# EAGLE design umodular_brain8_arduino_mega_rev01 (EAGLE 7.2.0)
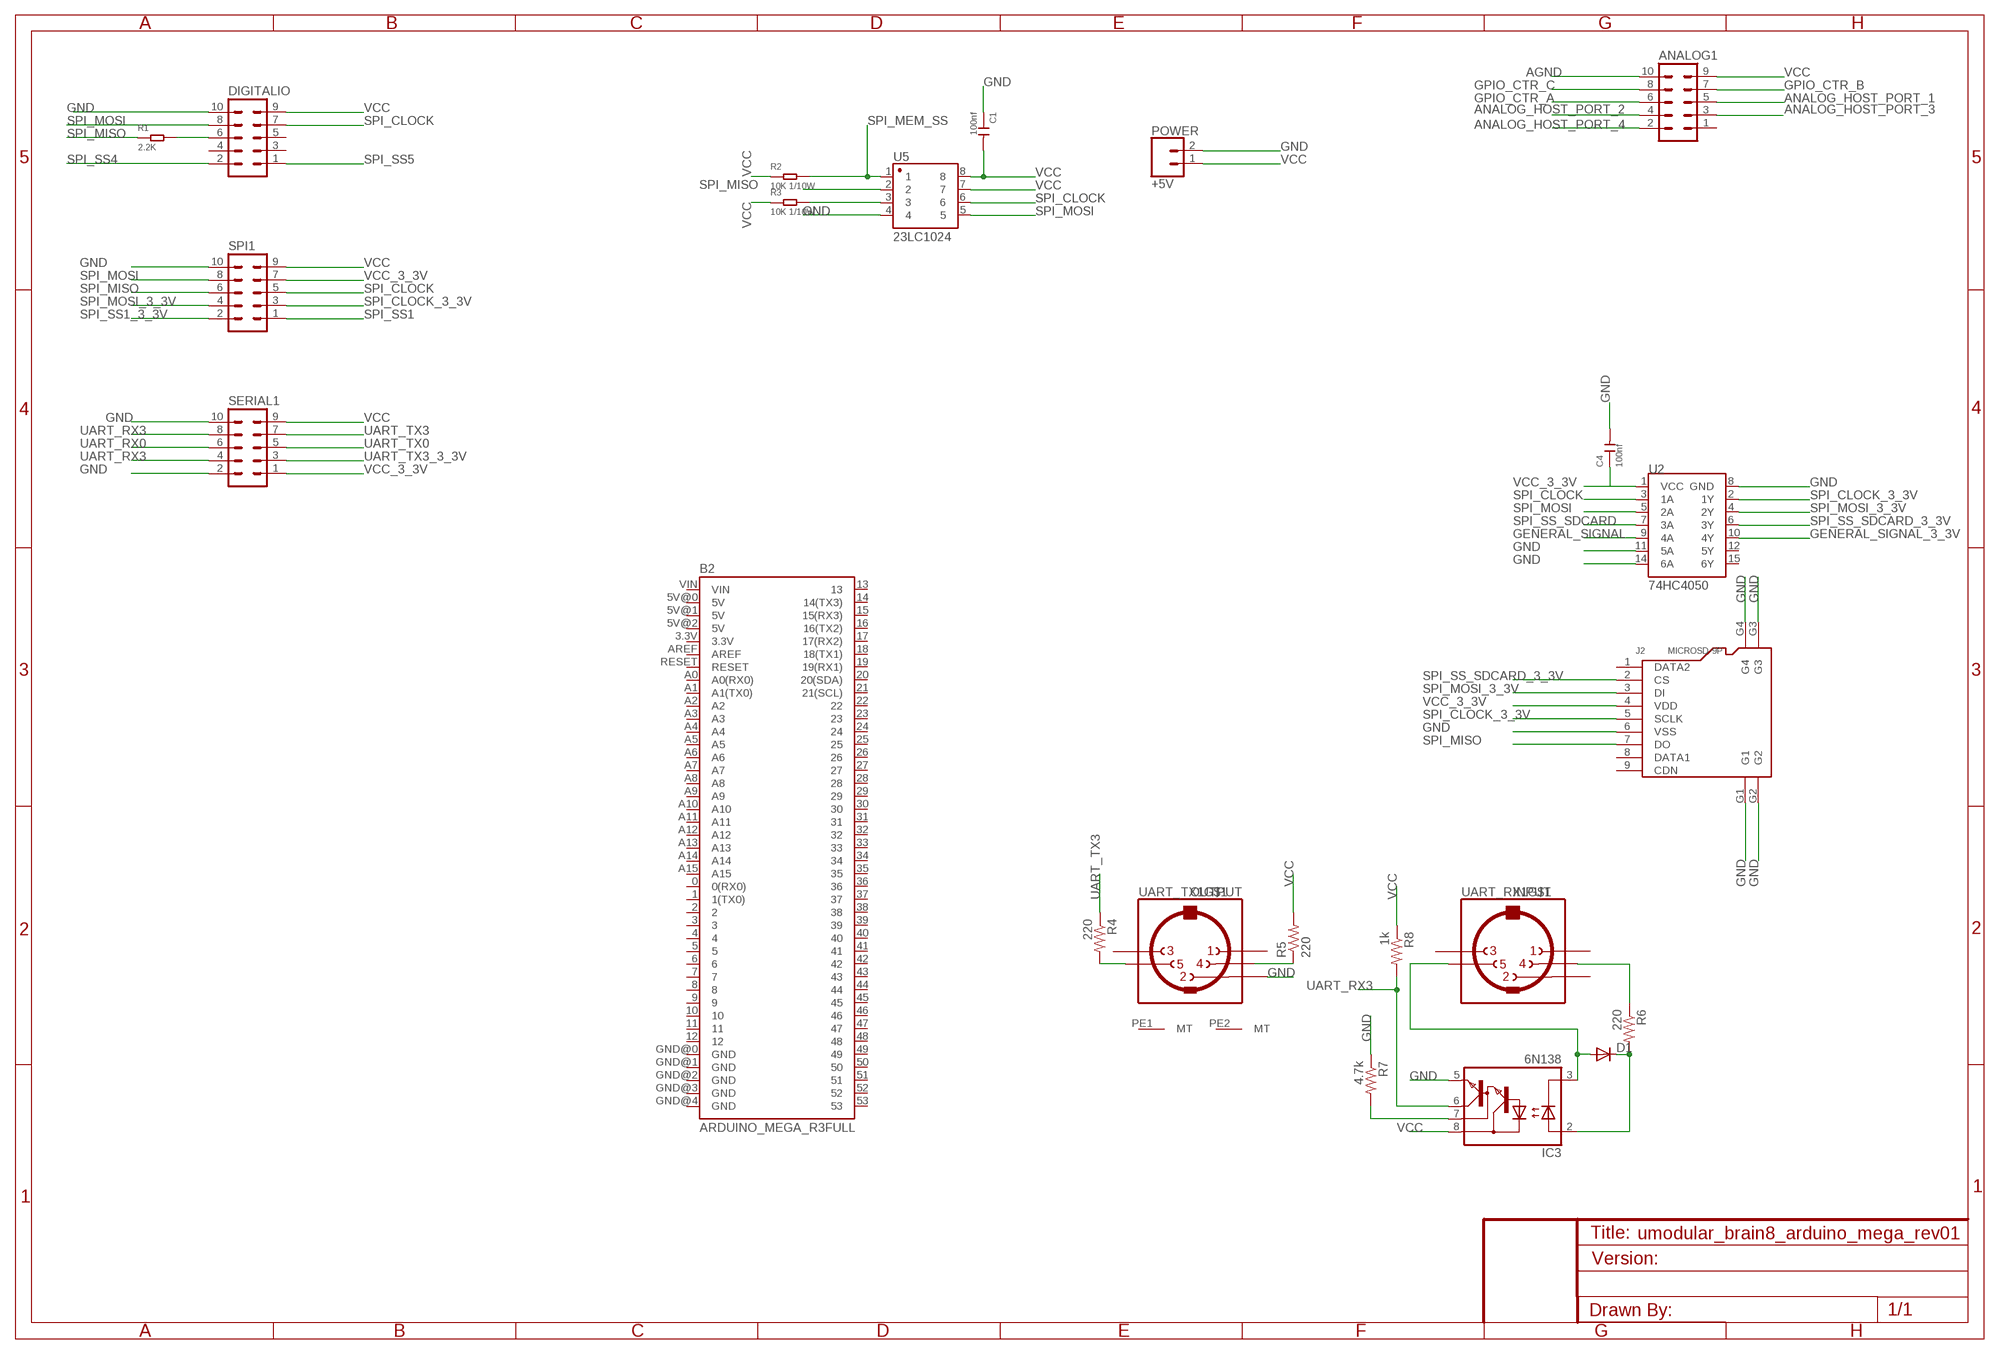
[diagram p0: schematic, sheet 1]

## Parts
ANALOG1  MA05-2  [MA05-2]
B2  ARDUINO_MEGA_R3FULL  [ARDUINO_MEGA]
C1  100nf  CERAMIC-100NF-50V-10%-X7R(0805)  [C0805]
C4  100nf  CERAMIC-100NF-50V-10%-X7R(0805)  [C0805]
D1  1N4148DO35-7  [DO35-7]
DIGITALIO  MA05-2  [MA05-2]
IC3  6N138  [DIL08]
J2  MICROSD-9P  MICRO-SD-CARD-HOLDER-9P  [MICRO-SD9+4P-SMD-16.1X14.5X1.85MM]
POWER  +5V  CONN_02LOCK_LONGPADS  [1X02_LOCK_LONGPADS]
R1  2.2K  SMD-RES-2.2K-5%-1/10W(0603)  [R0603]
R2  10K 1/10W  SMD-RES-10K-5%-1/10W(0603)  [R0603]
R3  10K 1/10W  SMD-RES-10K-5%-1/10W(0603)  [R0603]
R4  220  R-US_0204/7  [0204/7@1]
R5  220  R-US_0204/7  [0204/7@1]
R6  220  R-US_0204/7  [0204/7@1]
R7  4.7k  R-US_0204/7  [0204/7@1]
R8  1k  R-US_0204/7  [0204/7@1]
SERIAL1  MA05-2  [MA05-2]
SPI1  MA05-2  [MA05-2]
U2  74HC4050  HEX_CONVERTER  [SO16]
U5  23LC1024  GENERIC-SOIC8MSGEQ7N-FILTER  [SO08]
UART_RX1  INPUT  MIDIJACK  [CP-2350]
UART_TX1  OUTPUT  MIDIJACK  [CP-2350]

## Nets
AGND: ANALOG1.10
ANALOG_HOST_PORT_1: ANALOG1.5
ANALOG_HOST_PORT_2: ANALOG1.4
ANALOG_HOST_PORT_3: ANALOG1.3
ANALOG_HOST_PORT_4: ANALOG1.2
GENERAL_SIGNAL: U2.9(4A)
GENERAL_SIGNAL_3_3V: U2.10(4Y)
GND: C1.1 C4.2 DIGITALIO.10 IC3.5(GND) J2.6(VSS) J2.G1 J2.G2 J2.G3 J2.G4 POWER.2 R7.1 SERIAL1.2 SERIAL1.10 SPI1.10 U2.8(GND) U2.11(5A) U2.14(6A) U5.4 UART_TX1.2
GPIO_CTR_A: ANALOG1.6
GPIO_CTR_B: ANALOG1.7
GPIO_CTR_C: ANALOG1.8
N$2: R5.1 UART_TX1.4
N$3: R4.2 UART_TX1.5
N$4: R3.2 U5.3
N$5: R6.1 UART_RX1.4
N$6: D1.C IC3.2(A) R6.2
N$7: D1.A IC3.3(C) UART_RX1.5
N$8: IC3.7(VB) R7.2
N$9: DIGITALIO.6 R1.2
SPI_CLOCK: DIGITALIO.7 SPI1.5 U2.3(1A) U5.6
SPI_CLOCK_3_3V: J2.5(SCLK) SPI1.3 U2.2(1Y)
SPI_MEM_SS: R2.2 U5.1
SPI_MISO: J2.7(DO) R1.1 SPI1.6 U5.2
SPI_MOSI: DIGITALIO.8 SPI1.8 U2.5(2A) U5.5
SPI_MOSI_3_3V: J2.3(DI) SPI1.4 U2.4(2Y)
SPI_SS1: SPI1.1
SPI_SS1_3_3V: SPI1.2
SPI_SS4: DIGITALIO.2
SPI_SS5: DIGITALIO.1
SPI_SS_SDCARD: U2.7(3A)
SPI_SS_SDCARD_3_3V: J2.2(CS) U2.6(3Y)
UART_RX0: SERIAL1.6
UART_RX3: IC3.6(VO) R8.2 SERIAL1.4 SERIAL1.8
UART_TX0: SERIAL1.5
UART_TX3: R4.1 SERIAL1.7
UART_TX3_3_3V: SERIAL1.3
VCC: ANALOG1.9 C1.2 DIGITALIO.9 IC3.8(VCC) POWER.1 R2.1 R3.1 R5.2 R8.1 SERIAL1.9 SPI1.9 U5.7 U5.8
VCC_3_3V: C4.1 J2.4(VDD) SERIAL1.1 SPI1.7 U2.1(VCC)
Unconnected: ANALOG1.1 B2.0(0(RX0)) B2.1(1(TX0)) B2.2 B2.3 B2.3.3V B2.4 B2.5 B2.5V@0(5V) B2.5V@1(5V) B2.5V@2(5V) B2.6 B2.7 B2.8 B2.9 B2.10 B2.11 B2.12 B2.13 B2.14(14(TX3)) B2.15(15(RX3)) B2.16(16(TX2)) B2.17(17(RX2)) B2.18(18(TX1)) B2.19(19(RX1)) B2.20(20(SDA)) B2.21(21(SCL)) B2.22 B2.23 B2.24 B2.25 B2.26 B2.27 B2.28 B2.29 B2.30 B2.31 B2.32 B2.33 B2.34 B2.35 B2.36 B2.37 B2.38 B2.39 B2.40 B2.41 B2.42 B2.43 B2.44 B2.45 B2.46 B2.47 B2.48 B2.49 B2.50 B2.51 B2.52 B2.53 B2.A0(A0(RX0)) B2.A1(A1(TX0)) B2.A2 B2.A3 B2.A4 B2.A5 B2.A6 B2.A7 B2.A8 B2.A9 B2.A10 B2.A11 B2.A12 B2.A13 B2.A14 B2.A15 B2.AREF B2.GND@0(GND) B2.GND@1(GND) B2.GND@2(GND) B2.GND@3(GND) B2.GND@4(GND) B2.RESET B2.VIN DIGITALIO.3 DIGITALIO.4 DIGITALIO.5 J2.1(DATA2) J2.8(DATA1) J2.9(CDN) U2.12(5Y) U2.15(6Y) UART_RX1.1 UART_RX1.2 UART_RX1.3 UART_RX1.PE1(MT) UART_RX1.PE2(MT) UART_RX1.PE(MT) UART_RX1.PE@(MT) UART_TX1.1 UART_TX1.3 UART_TX1.PE1(MT) UART_TX1.PE2(MT) UART_TX1.PE(MT) UART_TX1.PE@(MT)

## Library data of the parts
ANALOG1 DIGITALIO SERIAL1 SPI1 = con-lstb:MA05-2: PIN HEADER; OC_FARNELL: unknown; OC_NEWARK: unknown
B2 = SparkFun-Boards-mod:ARDUINO_MEGA_R3: Arduino Mega R3 ATmega2560 R3 compatible footprint. SparkFun Products: Arduino Mega 2560 R3 <https://www.sparkfun.com/products/11061>
C1 C4 = Seeed-Capacitor-2016:CERAMIC-100NF-50V-10%-X7R(0805): 302010165; MPN: CC0805KRX7R9BB104
D1 = diode:1N4148: DIODE high speed (Philips)
IC3 = optocoupler:6N138: MOTOROLA OPTO COUPLER; MF: VISHAY/TELEFUNKEN; MPN: 6N138; OC_FARNELL: 9860150; OC_NEWARK: 35K5294
J2 = Seeed-Connector -2016:MICRO-SD-CARD-HOLDER-9P: 320090008
POWER = SparkFun-Connectors:CONN_02: Multi connection point. Often used as Generic Header-pin footprint for 0.1 inch spaced/style header connections On any of the 0.1 inch spaced packages, you can populate with these: Break Away Headers - Straight <https://www.sparkfun.com/products/116> (PRT-00116) Break Away Male Headers - Right Angle <https://www.sparkfun.com/products/553> (PRT-00553) Female Headers <https://www.sparkfun.com/products/115> (PRT-00115) Break Away Headers - Machine Pin <https://www.sparkfun.com/products/117> (PRT-00117) Break Away Female Headers - Swiss Machine Pin <https://www.sparkfun.com/products/743> (PRT-00743) For SCREWTERMINALS and SPRING TERMINALS visit here: Screw Terimnals on SparkFun.com <https://www.sparkfun.com/search/results?term=Screw+Terminals> (5mm/3.5mm/2.54mm spacing) This device is also useful as a general connection point to wire up your design to another part of your project. Our various solder wires solder well into these plated through hole pads. Hook-Up Wire - Assortment (Stranded, 22 AWG) <https://www.sparkfun.com/products/11375> (PRT-11375) Hook-Up Wire - Assortment (Solid Core, 22 AWG) <https://www.sparkfun.com/products/11367> (PRT-11367) View the entire wire category on our website here <https://www.sparkfun.com/categories/141> Special notes: Molex polarized connector foot print use with: PRT-08233 with associated crimp pins and housings. 2.54_SCREWTERM for use with PRT-10571. 3.5mm Screw Terminal footprints for PRT-08084 5mm Screw Terminal footprints for use with PRT-08432
R1 = Seeed-Resistor-2016:SMD-RES-2.2K-5%-1/10W(0603): 301010124; MPN: RC0603JR-072K2L
R2 R3 = Seeed-Resistor-2016:SMD-RES-10K-5%-1/10W(0603): 301010293; MPN: RC0603JR-0710KL
R4-R8 = rcl:R-US_: RESISTOR, American symbol
U2 = SparkFun-IC-Comms:HEX_CONVERTER: 74HC4050 Hex Buffer 74HC4050 Hex Buffer Level Shifter SMD SO016 SparkFun Products CAN-BUS Shield <https://www.sparkfun.com/products/13262> (DEV-13262) SparkFun MP3 Player Shield <https://www.sparkfun.com/products/12660> (DEV-12660) SparkFun microSD Shield <https://www.sparkfun.com/products/12761> (DEV-12761) SparkFun USB Host Shield <https://www.sparkfun.com/products/9947> (DEV-09947); PROD_ID: IC-09604
U5 = SparkFun-Retired:GENERIC-SOIC8: A placeholder for generic narrow & wide SOIC8 foorptints - used on the DIP adapter board. Has strange reference to IC-10141, a Seven Band Graphic Equalizer Display Filter SOIC-8 VFP: IC-10141; PROD_ID: IC-10141
UART_RX1 UART_TX1 = adafruit:MIDIJACK: DIN 5 jack also known as MIDI jack A modification of conn-hirshman:MAB5SH with two options for the grounding 'teeth'

## Net classes
0 default: width 0.305 mm

## Board
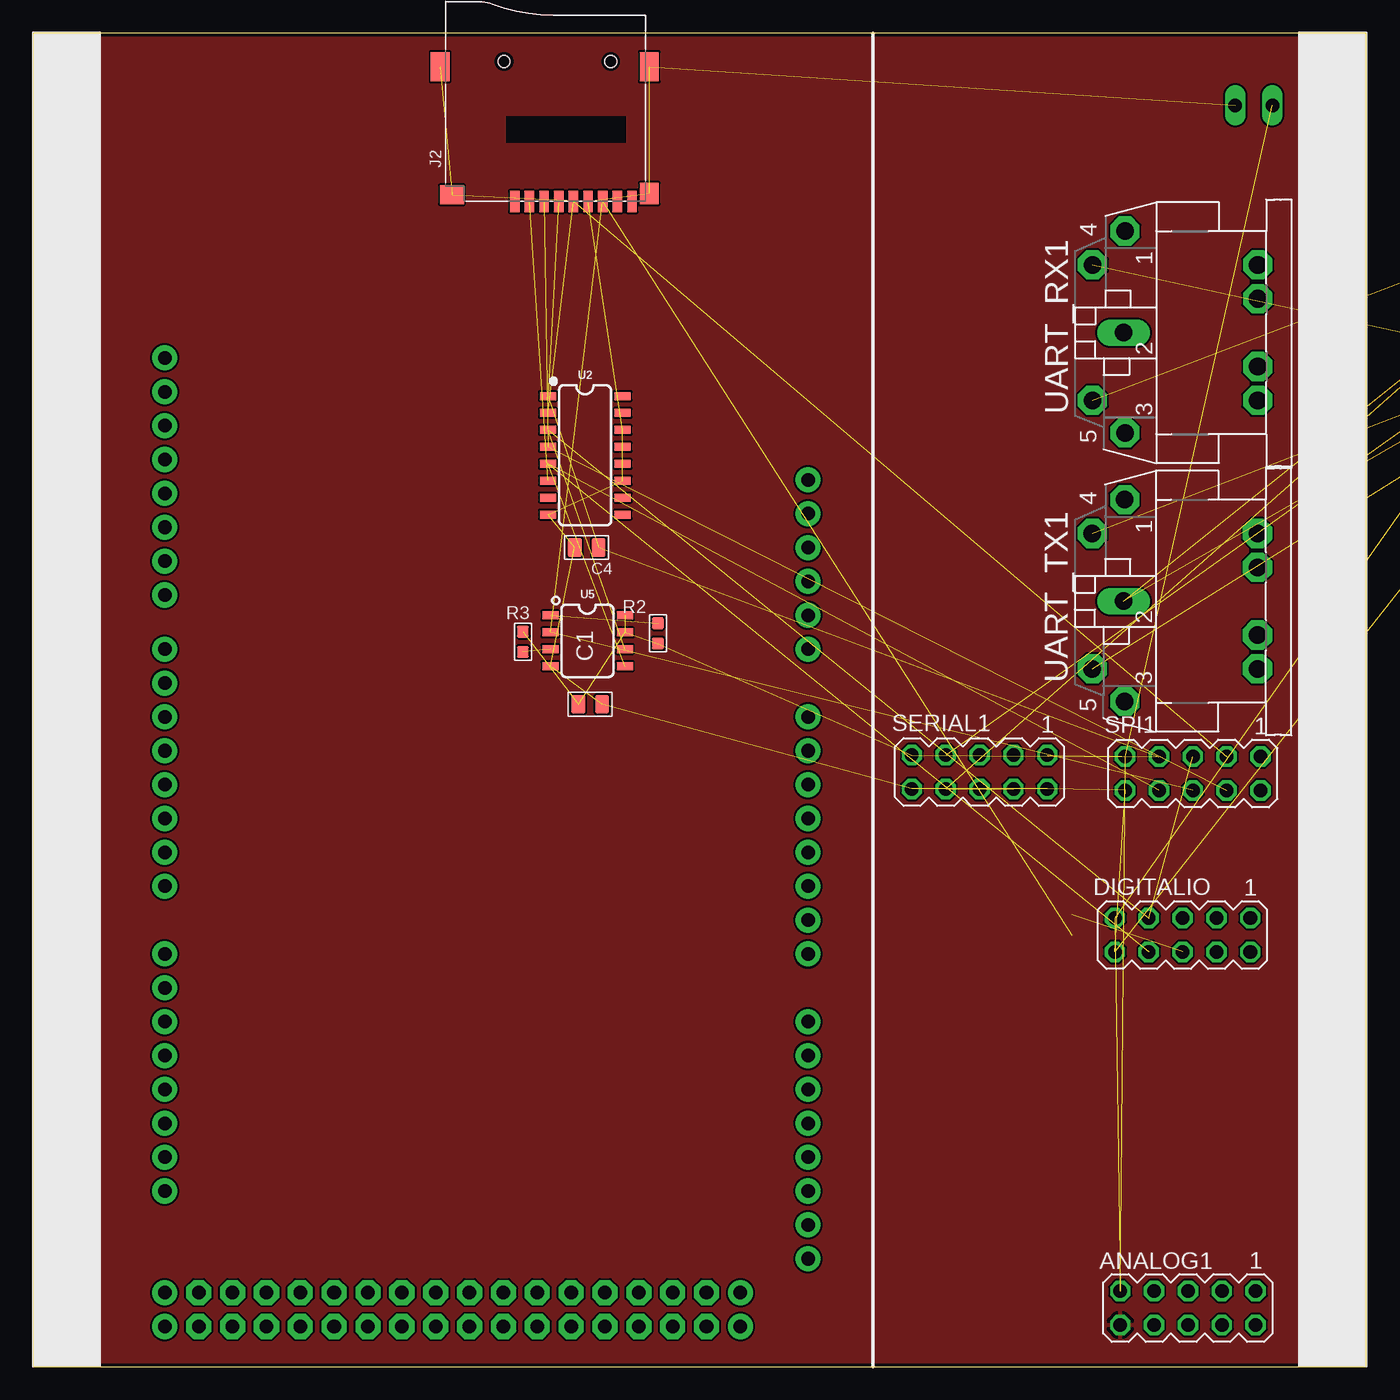
[diagram p1: board, top side]
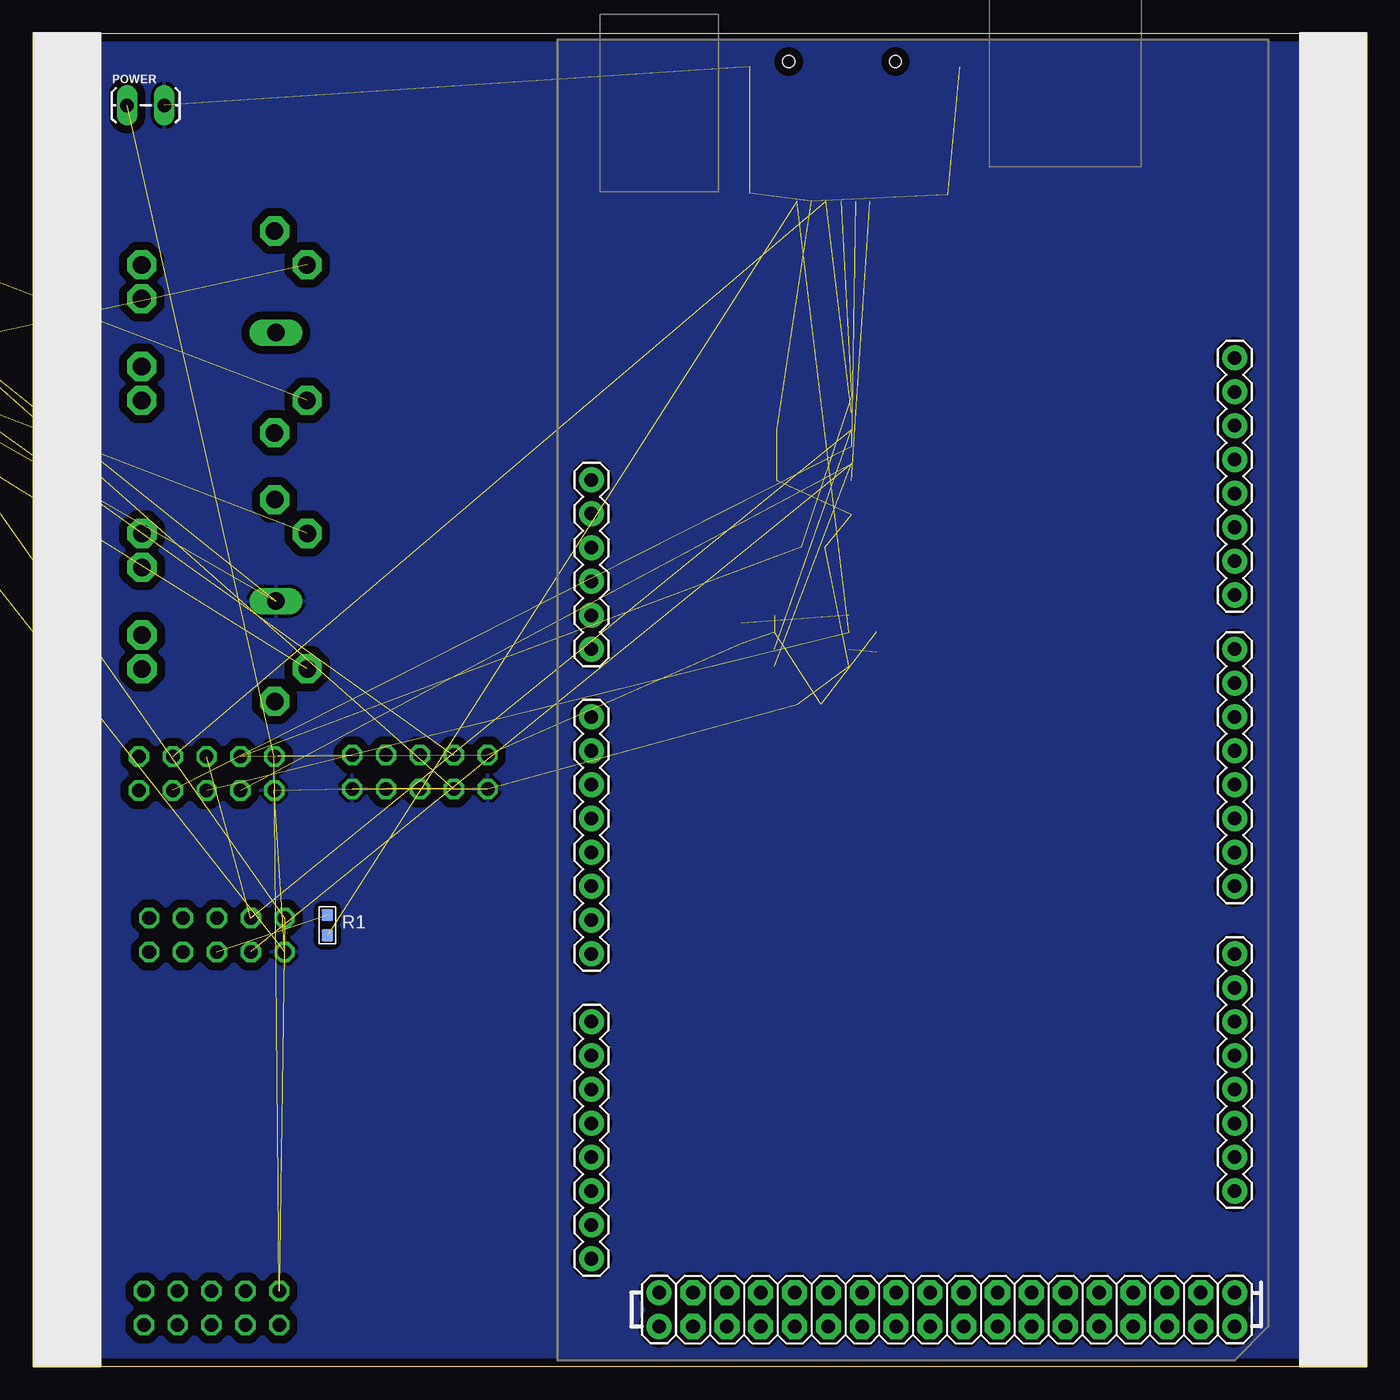
[diagram p2: board, bottom side, seen from below]

Size 100 x 100 mm. Coordinates in mm from the lower left corner, seen from the top.
Outline: 0,0 100,0 100,100 0,100 0,0
Copper layers (1*16): Top 0.035mm / dielectric 1.5mm / Bottom 0.035mm
Design rules "SeeedStudio_2layer_DRU_no_angle_20140221": minimum track width 6mil, minimum drill 12mil, track to track 6mil, track to pad 6mil, pad to pad 6mil, via to via 6mil, smd to smd 0mil, copper to edge 10mil, drill to drill 10mil, minimum pad ring 10mil, minimum via ring 6mil, stop-mask expansion 2mil, vias tented up to drill 100mil, thermal gap 10mil

### Footprints (pad centres in the part's own frame; a part is rotated, then mirrored left to right if it is on the bottom)
MA05-2 = drill 1.016 octagon: 1 -5.08,-1.27; 2 -5.08,1.27; 3 -2.54,-1.27; 4 -2.54,1.27; 5 0,-1.27; 6 0,1.27; 7 2.54,-1.27; 8 2.54,1.27; 9 5.08,-1.27; 10 5.08,1.27
ARDUINO_MEGA = drill 1.016 pad 1.88: 0 13.97,24.13; 1 11.43,24.13; 2 8.89,24.13; 3 6.35,24.13; 3.3V -13.97,-24.13; 4 3.81,24.13; 5 1.27,24.13; 5V@0 -11.43,-24.13; 5V@1 44.45,24.13; 5V@2 46.99,24.13; 6 -1.27,24.13; 7 -3.81,24.13; 8 -7.874,24.13; 9 -10.414,24.13; 10 -12.954,24.13; 11 -15.494,24.13; 12 -18.034,24.13; 13 -20.574,24.13; 14 19.05,24.13; 15 21.59,24.13; 16 24.13,24.13; 17 26.67,24.13; 18 29.21,24.13; 19 31.75,24.13; 20 34.29,24.13; 21 36.83,24.13; A0 1.27,-24.13; A1 3.81,-24.13; A2 6.35,-24.13; A3 8.89,-24.13; A4 11.43,-24.13; A5 13.97,-24.13; A6 16.51,-24.13; A7 19.05,-24.13; A8 24.13,-24.13; A9 26.67,-24.13; A10 29.21,-24.13; A11 31.75,-24.13; A12 34.29,-24.13; A13 36.83,-24.13; A14 39.37,-24.13; A15 41.91,-24.13; AREF -25.654,24.13; GND@0 -8.89,-24.13; GND@1 -6.35,-24.13; GND@2 44.45,-19.05; GND@3 46.99,-19.05; GND@4 -23.114,24.13; RESET -16.51,-24.13; VIN -3.81,-24.13 | drill 1.016 pad 1.88 octagon: 22 44.45,21.59; 23 46.99,21.59; 24 44.45,19.05; 25 46.99,19.05; 26 44.45,16.51; 27 46.99,16.51; 28 44.45,13.97; 29 46.99,13.97; 30 44.45,11.43; 31 46.99,11.43; 32 44.45,8.89; 33 46.99,8.89; 34 44.45,6.35; 35 46.99,6.35; 36 44.45,3.81; 37 46.99,3.81; 38 44.45,1.27; 39 46.99,1.27; 40 44.45,-1.27; 41 46.99,-1.27; 42 44.45,-3.81; 43 46.99,-3.81; 44 44.45,-6.35; 45 46.99,-6.35; 46 44.45,-8.89; 47 46.99,-8.89; 48 44.45,-11.43; 49 46.99,-11.43; 50 44.45,-13.97; 51 46.99,-13.97; 52 44.45,-16.51; 53 46.99,-16.51
C0805 = smd 1.397 x 1.016: 1 0,0.889; 2 0,-0.889
DO35-7 = drill 0.813 long: A 3.81,0; C -3.81,0
DIL08 = drill 0.813 offset: 1 -3.81,-3.81; 2 -1.27,-3.81; 3 1.27,-3.81; 4 3.81,-3.81; 5 3.81,3.81; 6 1.27,3.81; 7 -1.27,3.81; 8 -3.81,3.81
MICRO-SD9+4P-SMD-16.1X14.5X1.85MM = smd 1.6 x 0.7: 1 0,2.25; 2 0,1.15; 3 0,0.05; 4 0,-1.05; 5 0,-2.15; 6 0,-3.25; 7 0,-4.35; 8 0,-5.45; 9 0,-6.55 | smd 1.6 x 1.4: G1 0.6,-7.85 | smd 2.2 x 1.4: G2 10.1,-7.85; G3 10.1,7.85 | smd 1.4 x 1.8: G4 0.5,6.95 | hole 0.9: 10.5,-4.95; 10.5,3.05
1X02_LOCK_LONGPADS = drill 1.016 long: 1 -0.127,0; 2 2.667,0
R0603 = smd 0.889 x 0.889: 1 0,0.762; 2 0,-0.762
0204/7@1 = drill 0.813 octagon: 1 -3.81,0; 2 3.81,0
SO16 = smd 0.6 x 1.2: 1 -4.445,-2.8; 2 -3.175,-2.8; 3 -1.905,-2.8; 4 -0.635,-2.8; 5 0.635,-2.8; 6 1.905,-2.8; 7 3.175,-2.8; 8 4.445,-2.8; 9 4.445,2.8; 10 3.175,2.8; 11 1.905,2.8; 12 0.635,2.8; 13 -0.635,2.8; 14 -1.905,2.8; 15 -3.175,2.8; 16 -4.445,2.8
SO08 = smd 0.6 x 1.2: 1 -1.905,-2.8; 2 -0.635,-2.8; 3 0.635,-2.8; 4 1.905,-2.8; 5 1.905,2.8; 6 0.635,2.8; 7 -0.635,2.8; 8 -1.905,2.8
OLED_0.96_I2C = hole 2.8: 2.5,6.25; 2.5,18.75
CP-2350 = drill 1.321 pad 2.184 octagon: 1 7.62,12.58; 3 -7.52,12.58; 4 5.08,15.02; 5 -5.08,15.02; PE -2.54,2.62; PE1 -5.08,2.62; PE2 5.08,2.62; PE@ 2.54,2.62 | drill 1.321 long: 2 0,12.68

### Placement (x,y rotation side)
ANALOG1  86.64,4.39 180 top
B2  34,50 270 bottom
C1  41.78,49.67 270 top
C4  41.51,61.44 270 top
D1  110.8,80.59 0 top  (outside the outline)
DIGITALIO  86.23,32.38 180 top
IC3  132.16,96.89 0 top  (outside the outline)
J2  38.37,87.39 90 top
POWER  92.84,94.6 0 bottom
R1  77.94,33.11 180 bottom
R2  46.86,54.99 180 top
R3  36.73,54.36 0 top
R4  121.51,80.93 0 top  (outside the outline)
R5  131.19,80.93 0 top  (outside the outline)
R6  109.77,76.88 0 top  (outside the outline)
R7  119.45,76.88 0 top  (outside the outline)
R8  129.13,76.88 0 top  (outside the outline)
SERIAL1  71,44.6 180 top
SPI1  87,44.48 180 top
U2  41.41,68.35 270 top
U5  41.59,54.44 270 top
U$1  [OSHW-LOGO-M]  113.14,15.36 0 top  (outside the outline)
U$2  [OLED_0.96_I2C]  0,0 0 top
U$3  [OLED_0.96_I2C]  0,25 0 top
U$4  [OLED_0.96_I2C]  0,50 0 top
U$5  [OSHW-LOGO-L]  116.75,34.27 90 top  (outside the outline)
U$6  [OLED_0.96_I2C]  0,75 0 top
U$7  [OLED_0.96_I2C]  95,0 0 top
U$8  [OLED_0.96_I2C]  95,25 0 top
U$9  [OLED_0.96_I2C]  95,50 0 top
U$10  [OLED_0.96_I2C]  95,75 0 top
UART_RX1  94.49,77.55 90 top
UART_TX1  94.47,57.41 90 top

### Tracks (layer width: path | path; a pad name or v marks a point on that pad's centre or on a via)
AGND
  pour Top: 100.25,99.89 100.25,0.05 0.05,0.05 -0.07,99.95
GND  (18 unrouted)
  pour Bottom (isolate 0.61): -0.02,100.11 100.2,99.91 100.12,-0.2 0,-0.12
N$2  (1 unrouted)
N$3  (1 unrouted)
N$4  (1 unrouted)
N$5  (1 unrouted)
N$6  (2 unrouted)
N$7  (2 unrouted)
N$8  (1 unrouted)
N$9  (1 unrouted)
SPI_CLOCK  (3 unrouted)
SPI_CLOCK_3_3V  (2 unrouted)
SPI_MEM_SS  (1 unrouted)
SPI_MISO  (3 unrouted)
SPI_MOSI  (3 unrouted)
SPI_MOSI_3_3V  (2 unrouted)
SPI_SS_SDCARD_3_3V  (1 unrouted)
UART_RX3  (3 unrouted)
UART_TX3  (1 unrouted)
VCC  (12 unrouted)
VCC_3_3V  (4 unrouted)

### Text on the board
Bottom: uMODULAR Shield rev. 0.2 / CC-BY-SA 4 / Romulo Silva / http://midilab.co
tNames: Right: Bottom Boards / Left: Top Boards | uMODULAR Arduino Mega Shield / / by Romulo Silva - http://midilab.co